# EAGLE design picboard (EAGLE 7.5.0)
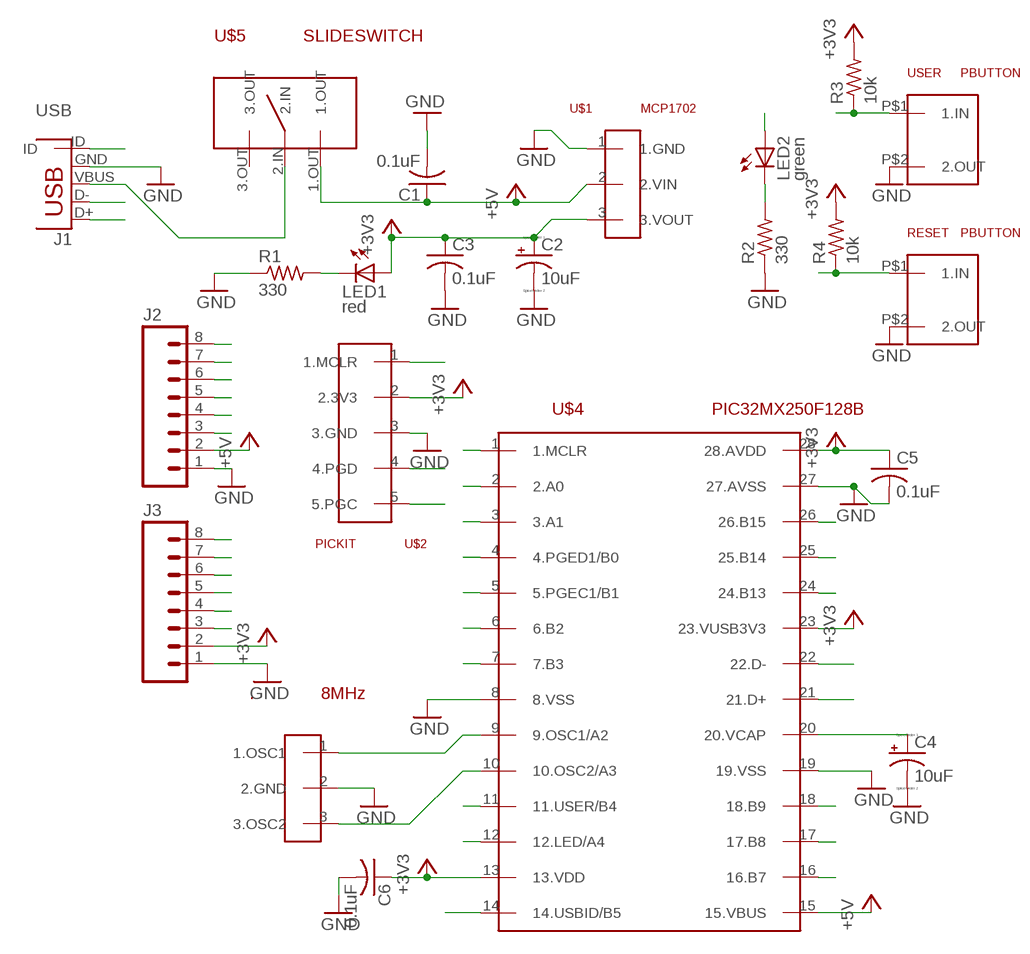
[diagram p0: schematic, sheet 1]

## Parts
.  8MHz  OSCIL  [1X03]
C1  0.1uF  C-US025-025X050  [C025-025X050]
C2  10uF  CPOL-USB45181A  [B45181A]
C3  0.1uF  C-US025-025X050  [C025-025X050]
C4  10uF  CPOL-USB45181A  [B45181A]
C5  0.1uF  C-US025-025X050  [C025-025X050]
C6  0.1uF  C-US025-025X050  [C025-025X050]
J1  USB  [USB-MB-H]
J2  M08  [1X08_ROUND]
J3  M08  [1X08_ROUND]
LED1  red  LED3MM  [LED3MM]
LED2  green  LED3MM  [LED3MM]
R1  330  R-US_0207/10  [0207/10]
R2  330  R-US_0207/10  [0207/10]
R3  10k  R-US_0207/10  [0207/10]
R4  10k  R-US_0207/10  [0207/10]
RESET  PBUTTON  [PBUTTON]
U$1  MCP1702  [TO92]
U$2  PICKIT  [1X05]
U$4  PIC32MX250F128B  [DIL28-3]
U$5  SLIDESWITCH  [SLIDESWITCH]
USER  PBUTTON  [PBUTTON]

## Nets
+3V3: C2.+ C3.1 C5.1 C6.1 J3.2 LED1.A R3.2 R4.2 U$1.3(3.VOUT) U$2.2(2.3V3) U$4.13(13.VDD) U$4.23(23.VUSB3V3) U$4.28(28.AVDD)
+5V: C1.1 J2.2 U$1.2(2.VIN) U$4.15(15.VBUS) U$5.1.OUT
A0: J3.8 U$4.2(2.A0)
A1: J3.7 U$4.3(3.A1)
B2: J3.6 U$4.6(6.B2)
B3: J3.5 U$4.7(7.B3)
B7: J2.3 U$4.16(16.B7)
B8: J2.4 U$4.17(17.B8)
B9: J2.5 U$4.18(18.B9)
B13: J2.6 U$4.24(24.B13)
B14: J2.7 U$4.25(25.B14)
B15: J2.8 U$4.26(26.B15)
D+: J1.D+ U$4.21(21.D+)
D-: J1.D- U$4.22(22.D-)
GND: ..2(2.GND) C1.2 C2.- C3.2 C4.- C5.2 C6.2 J1.GND J2.1 J3.1 R1.1 R2.1 RESET.P$2(2.OUT) U$1.1(1.GND) U$2.3(3.GND) U$4.8(8.VSS) U$4.19(19.VSS) U$4.27(27.AVSS) USER.P$2(2.OUT)
LED/A4: J3.3 LED2.A U$4.12(12.LED/A4)
MCLR: R4.1 RESET.P$1(1.IN) U$2.1(1.MCLR) U$4.1(1.MCLR)
N$1: J1.VBUS U$5.2.IN
N$2: LED1.K(C) R1.2
N$3: LED2.K(C) R2.2
N$4: C4.+ U$4.20(20.VCAP)
N$5: ..1(1.OSC1) U$4.9(9.OSC1/A2)
N$6: ..3(3.OSC2) U$4.10(10.OSC2/A3)
PGC: U$2.5(5.PGC) U$4.5(5.PGEC1/B1)
PGD: U$2.4(4.PGD) U$4.4(4.PGED1/B0)
USBID: J1.ID U$4.14(14.USBID/B5)
USER/B4: J3.4 R3.1 U$4.11(11.USER/B4) USER.P$1(1.IN)
Unconnected: U$5.3.OUT

## Library data of the parts
. = PIC32:OSCIL
C1 C3 C5 C6 = PIC32:C-US: CAPACITOR, American symbol
C2 C4 = PIC32:CPOL-US: POLARIZED CAPACITOR, American symbol
J1 = PIC32:USB: USB Connectors USB-B-PTH is fully proven SKU : PRT-00139/CONN-08278 USB-miniB is fully proven SKU : PRT-00587 USB-A-PCB is untested. USB-A-H is throughly reviewed, but untested. Spark Fun Electronics SKU : PRT-00437 USB-B-SMT is throughly reviewed, but untested. Needs silkscreen touching up. USB-A-S has not been used/tested USB-MB-H has not been used/tested USB-MICROB has been used. CONN-09505
J2 J3 = PIC32:M08: Header 8 Standard 8-pin 0.1" header. Use with straight break away headers (SKU : PRT-00116), right angle break away headers (PRT-00553), swiss pins (PRT-00743), machine pins (PRT-00117), and female headers (PRT-00115).; PROD_ID: CONN-08437
LED1 LED2 = PIC32:LED: LED OSRAM: - CHIPLED LG R971, LG N971, LY N971, LG Q971, LY Q971, LO R971, LY R971 LH N974, LH R974 LS Q976, LO Q976, LY Q976 LO Q996 - Hyper CHIPLED LW Q18S LB Q993, LB Q99A, LB R99A - SideLED LS A670, LO A670, LY A670, LG A670, LP A670 LB A673, LV A673, LT A673, LW A673 LH A674 LY A675 LS A676, LA A676, LO A676, LY A676, LW A676 LS A679, LY A679, LG A679 - Hyper Micro SIDELED® LS Y876, LA Y876, LO Y876, LY Y876 LT Y87S - SmartLED LW L88C, LW L88S LB L89C, LB L89S, LG L890 LS L89K, LO L89K, LY L89K LS L896, LA L896, LO L896, LY L896 - TOPLED LS T670, LO T670, LY T670, LG T670, LP T670 LSG T670, LSP T670, LSY T670, LOP T670, LYG T670 LG T671, LOG T671, LSG T671 LB T673, LV T673, LT T673, LW T673 LH T674 LS T676, LA T676, LO T676, LY T676, LB T676, LH T676, LSB T676, LW T676 LB T67C, LV T67C, LT T67C, LS T67K, LO T67K, LY T67K, LW E67C LS E67B, LA E67B, LO E67B, LY E67B, LB E67C, LV E67C, LT E67C LW T67C LS T679, LY T679, LG T679 LS T770, LO T770, LY T770, LG T770, LP T770 LB T773, LV T773, LT T773, LW T773 LH T774 LS E675, LA E675, LY E675, LS T675 LS T776, LA T776, LO T776, LY T776, LB T776 LHGB T686 LT T68C, LB T68C - Hyper Mini TOPLED® LB M676 - Mini TOPLED Santana® LG M470 LS M47K, LO M47K, LY M47K Source: http://www.osram.convergy.de LUXEON: - LUMILED® LXK2-PW12-R00, LXK2-PW12-S00, LXK2-PW14-U00, LXK2-PW14-V00 LXK2-PM12-R00, LXK2-PM12-S00, LXK2-PM14-U00 LXK2-PE12-Q00, LXK2-PE12-R00, LXK2-PE12-S00, LXK2-PE14-T00, LXK2-PE14-U00 LXK2-PB12-K00, LXK2-PB12-L00, LXK2-PB12-M00, LXK2-PB14-N00, LXK2-PB14-P00, LXK2-PB14-Q00 LXK2-PR12-L00, LXK2-PR12-M00, LXK2-PR14-Q00, LXK2-PR14-R00 LXK2-PD12-Q00, LXK2-PD12-R00, LXK2-PD12-S00 LXK2-PH12-R00, LXK2-PH12-S00 LXK2-PL12-P00, LXK2-PL12-Q00, LXK2-PL12-R00 Source: www.luxeon.com KINGBRIGHT: KA-3528ASYC Source: www.kingbright.com
R1-R4 = PIC32:R-US_: RESISTOR, American symbol
RESET USER = PIC32:PBUTTON
U$1 = PIC32:MCP1702
U$2 = PIC32:PICKIT
U$4 = PIC32:PIC32MX250F128B
U$5 = PIC32:SLIDESWITCH

## Board
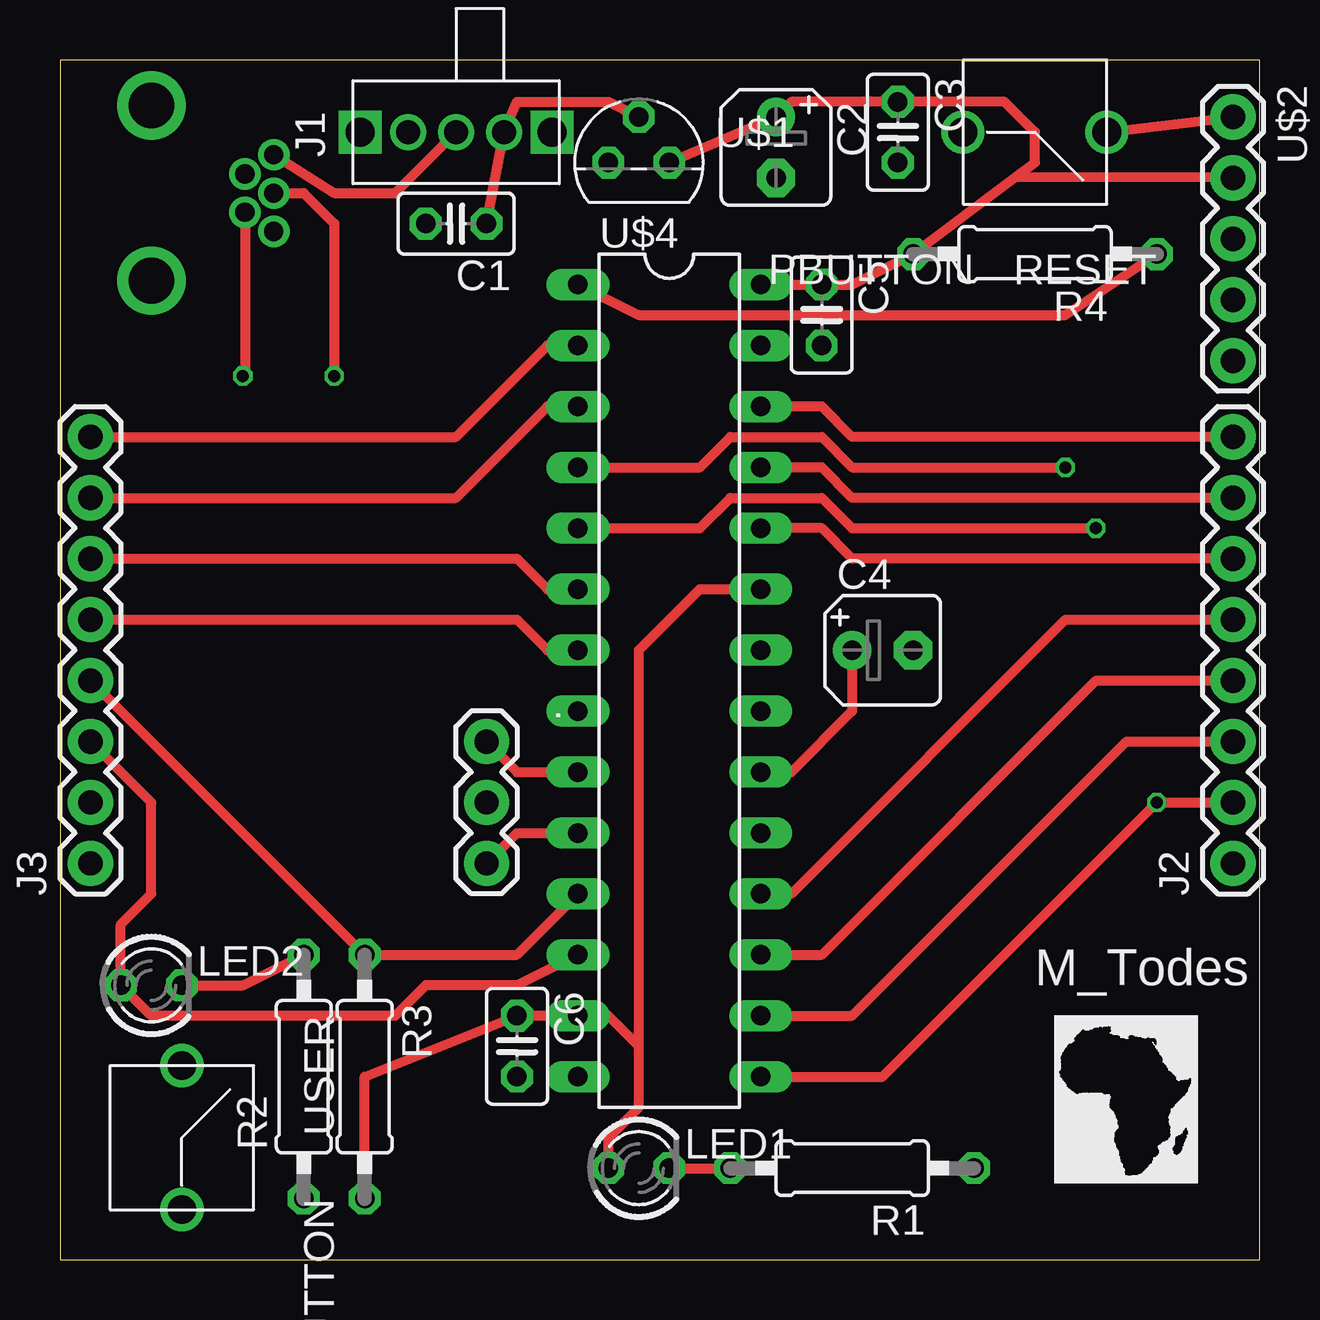
[diagram p1: board, top side]
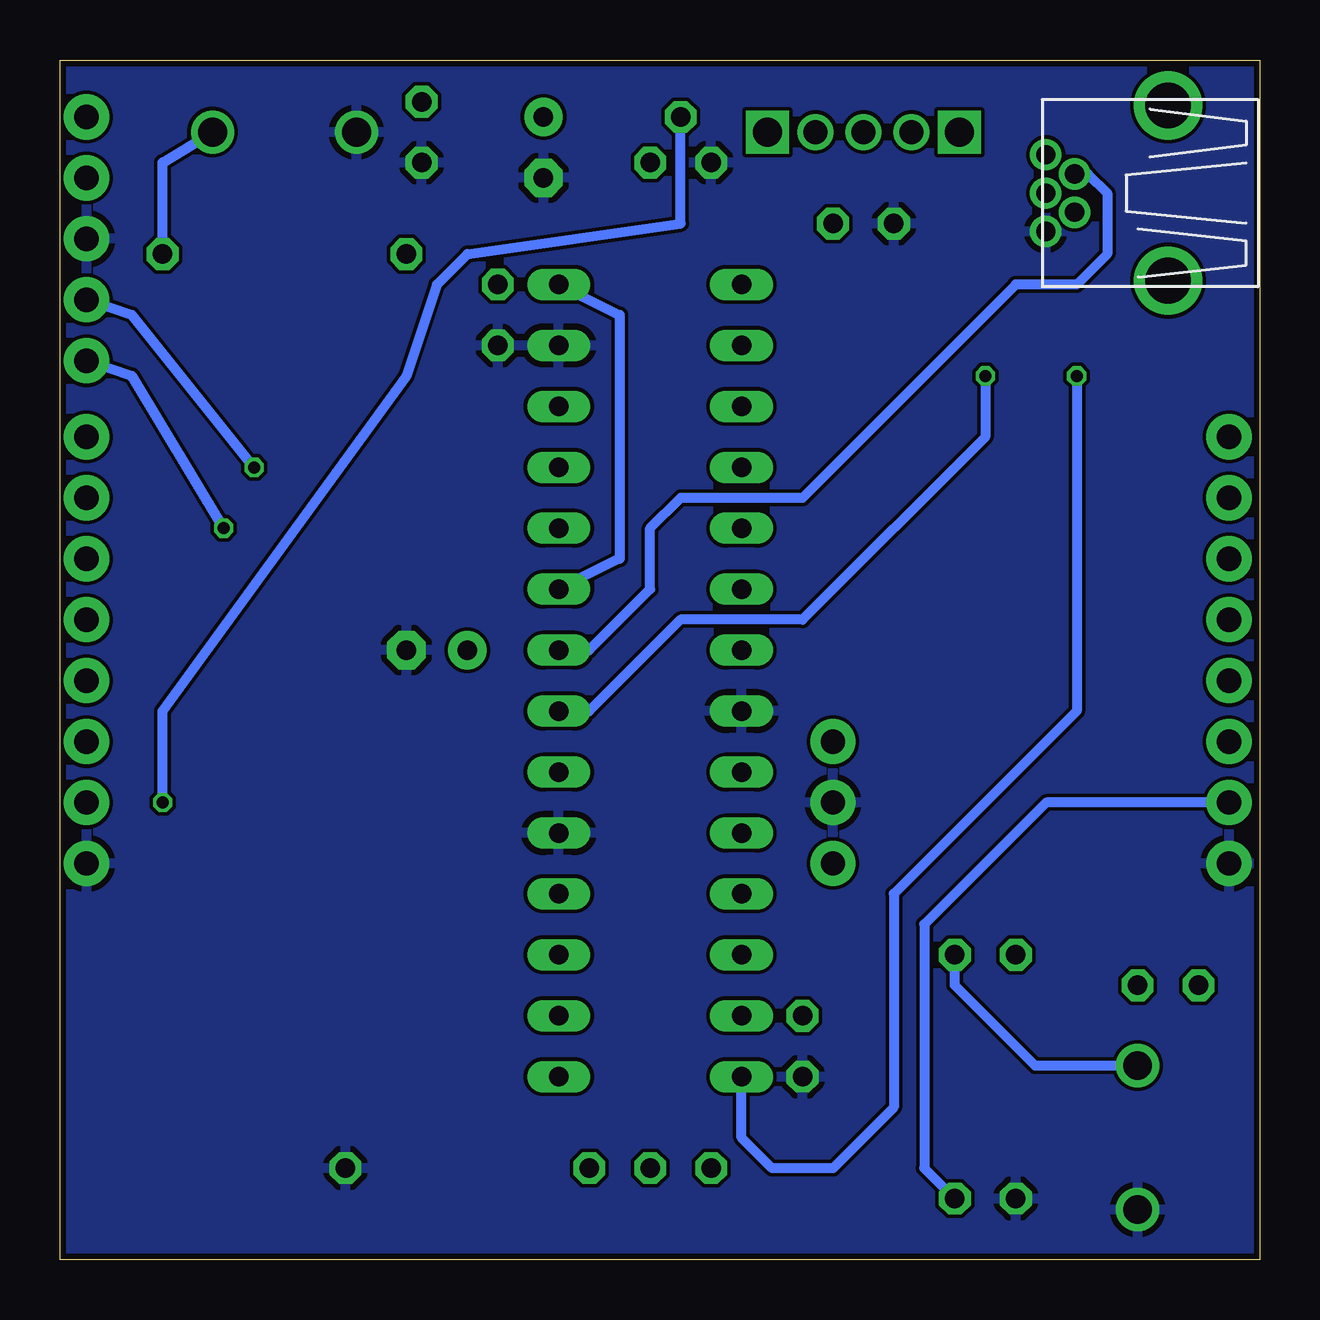
[diagram p2: board, bottom side, seen from below]

Size 50 x 50 mm. Coordinates in mm from the lower left corner, seen from the top.
Outline: 0,0 50,0 50,50 0,50 0,0
Copper layers (1*16): Top 0.035mm / dielectric 1.5mm / Bottom 0.035mm
Design rules "SeeedStudio_2layer_DRU_no_angle_20140221": minimum track width 6mil, minimum drill 12mil, track to track 6mil, track to pad 6mil, pad to pad 6mil, via to via 6mil, smd to smd 0mil, copper to edge 10mil, drill to drill 10mil, minimum pad ring 10mil, minimum via ring 6mil, stop-mask expansion 2mil, vias tented up to drill 100mil, thermal gap 10mil

### Footprints (pad centres in the part's own frame; a part is rotated, then mirrored left to right if it is on the bottom)
1X03 = drill 1.016 pad 1.88: 1 0,0; 2 2.54,0; 3 5.08,0
C025-025X050 = drill 0.813 octagon: 1 -1.27,0; 2 1.27,0
B45181A = drill 0.813 pad 1.6: + -1.27,0 | drill 0.813 pad 1.6 octagon: - 1.27,0
USB-MB-H = drill 0.8: D+ 5.1,0; D- 3.9,0.8; GND 5.1,-1.6; ID 3.9,-0.8; VBUS 5.1,1.6 | drill 1.9: P$6 0,-3.65; P$7 0,3.65
1X08_ROUND = drill 1.016 pad 1.88: 1 0,0; 2 2.54,0; 3 5.08,0; 4 7.62,0; 5 10.16,0; 6 12.7,0; 7 15.24,0; 8 17.78,0
LED3MM = drill 0.813 octagon: A -1.27,0; K 1.27,0
0207/10 = drill 0.813 octagon: 1 -5.08,0; 2 5.08,0
PBUTTON = drill 1.2: P$1 -3,0; P$2 3,0
TO92 = drill 0.813 octagon: 1 -1.27,0; 2 0,1.905; 3 1.27,0
1X05 = drill 1.016 pad 1.88: 1 0,0; 2 2.54,0; 3 5.08,0; 4 7.62,0; 5 10.16,0
DIL28-3 = drill 0.813 long: 1 -16.51,-3.81; 2 -13.97,-3.81; 3 -11.43,-3.81; 4 -8.89,-3.81; 5 -6.35,-3.81; 6 -3.81,-3.81; 7 -1.27,-3.81; 8 1.27,-3.81; 9 3.81,-3.81; 10 6.35,-3.81; 11 8.89,-3.81; 12 11.43,-3.81; 13 13.97,-3.81; 14 16.51,-3.81; 15 16.51,3.81; 16 13.97,3.81; 17 11.43,3.81; 18 8.89,3.81; 19 6.35,3.81; 20 3.81,3.81; 21 1.27,3.81; 22 -1.27,3.81; 23 -3.81,3.81; 24 -6.35,3.81; 25 -8.89,3.81; 26 -11.43,3.81; 27 -13.97,3.81; 28 -16.51,3.81
SLIDESWITCH = drill 1: 1.OUT 2,0; 2.IN 0,0; 3.OUT -2,0 | drill 1.2 square: P$4 -4,0; P$5 4,0

### Placement (x,y rotation side)
.  17.78,21.59 270 top
C1  16.51,43.18 180 top
C2  29.84,46.35 270 top
C3  34.92,46.99 270 top
C4  34.29,25.4 0 top
C5  31.75,39.37 270 top
C6  19.05,8.89 270 top
J1  3.81,44.45 0 top
J2  48.9,16.51 90 top
J3  1.27,16.51 90 top
LED1  24.13,3.81 0 top
LED2  3.81,11.43 0 top
R1  33.02,3.81 180 top
R2  10.16,7.62 90 top
R3  12.7,7.62 270 top
R4  40.64,41.91 180 top
RESET  40.64,46.99 180 top
U$1  24.13,45.72 0 top
U$2  48.9,47.62 270 top
U$4  25.4,24.13 270 top
U$5  16.51,46.99 0 top
USER  5.08,5.08 270 top

### Tracks (layer width: path | path; a pad name or v marks a point on that pad's centre or on a via)
+3V3
  Top 0.406: U$4.28 C5.1 33.02,40.64 R4.2 39.83,45.11 | LED1.A 22.86,5.08 24.13,6.35 24.13,8.89 | 24.13,8.89 22.86,10.16 U$4.13 C6.1 12.7,7.62 R3.2 | 24.13,8.89 24.13,25.4 26.67,27.94 U$4.23 | 39.83,45.11 40.64,45.72 40.64,46.99 39.37,48.26 C3.1 30.48,48.26 C2.+ U$1.3 | U$2.2 39.83,45.11
  Bottom 0.406: U$4.28 26.67,39.37 26.67,29.21 U$4.23 | J3.2 8.89,19.05 13.97,13.97 13.97,3.81 R3.2
+5V  (via drill 0.5)
  Top 0.406: U$4.15 34.29,7.62 v45.72,19.05 J2.2 | C1.1 U$5.1.OUT 19.05,48.26 22.86,48.26 U$1.2
  Bottom 0.406: v45.72,19.05 45.72,22.86 35.56,36.83 34.29,40.64 33.02,41.91 24.13,43.18 U$1.2
A0
  Top 0.406: J3.8 16.51,34.29 20.32,38.1 U$4.2
A1
  Top 0.406: J3.7 16.51,31.75 20.32,35.56 U$4.3
B2
  Top 0.406: J3.6 19.05,29.21 20.32,27.94 U$4.6
B3
  Top 0.406: J3.5 19.05,26.67 20.32,25.4 U$4.7
B7
  Top 0.406: U$4.16 33.02,10.16 44.45,21.59 J2.3
B8
  Top 0.406: U$4.17 31.75,12.7 43.18,24.13 J2.4
B9
  Top 0.406: U$4.18 30.48,15.24 41.91,26.67 J2.5
B13
  Top 0.406: J2.6 33.02,29.21 31.75,30.48 U$4.24
B14
  Top 0.406: J2.7 33.02,31.75 31.75,33.02 U$4.25
B15
  Top 0.406: J2.8 33.02,34.29 31.75,35.56 U$4.26
D+  (via drill 0.5)
  Top 0.406: J1.D+ 10.16,44.45 11.43,43.18 v11.43,36.83
  Bottom 0.406: v11.43,36.83 11.43,34.29 19.05,26.67 24.13,26.67 27.94,22.86 U$4.21
D-
  Bottom 0.406: J1.D- 7.15,45.25 6.35,44.45 6.35,41.91 7.62,40.64 10.16,40.64 19.05,31.75 24.13,31.75 25.4,30.48 25.4,27.94 27.94,25.4 U$4.22
GND
  pour Bottom: 0,49.53 0,0 50.8,0 50.8,49.53
LED/A4
  Top 0.406: U$4.12 19.05,11.43 15.24,11.43 13.97,10.16 3.81,10.16 LED2.A 2.54,13.97 3.81,15.24 3.81,19.05 J3.3
MCLR
  Top 0.406: U$4.1 24.13,39.37 41.91,39.37 R4.1 | RESET.P$1 U$2.1
  Bottom 0.406: R4.1 45.72,45.72 RESET.P$1
N$1
  Top 0.406: J1.VBUS 11.43,44.45 13.97,44.45 U$5.2.IN
N$2
  Top 0.406: LED1.K R1.2
N$3
  Top 0.406: LED2.K 7.62,11.43 R2.2
N$4
  Top 0.406: C4.+ 33.02,22.86 30.48,20.32 U$4.20
N$5
  Top 0.406: ..1 19.05,20.32 U$4.9
N$6
  Top 0.406: ..3 19.05,17.78 U$4.10
PGC  (via drill 0.5)
  Top 0.406: U$4.5 26.67,30.48 27.94,31.75 31.75,31.75 33.02,30.48 v43.18,30.48
  Bottom 0.406: v43.18,30.48 46.99,36.83 U$2.5
PGD  (via drill 0.5)
  Top 0.406: U$4.4 26.67,33.02 27.94,34.29 31.75,34.29 33.02,33.02 v41.91,33.02
  Bottom 0.406: v41.91,33.02 46.99,39.37 U$2.4
USBID  (via drill 0.5)
  Top 0.406: J1.ID 7.71,36.92 v7.62,36.83
  Bottom 0.406: v7.62,36.83 7.62,22.86 15.24,15.24 15.24,6.35 17.78,3.81 20.32,3.81 21.59,5.08 U$4.14
USER/B4
  Top 0.406: U$4.11 19.05,12.7 R3.1 J3.4
  Bottom 0.406: USER.P$1 9.35,8.08 12.7,11.43 R3.1

### Text on the board
tPlace: M_Todes